# Altium schematic sheet Sheet1.SchDoc
size OrCAD B; SheetNumber: 1; SheetTotal: 1
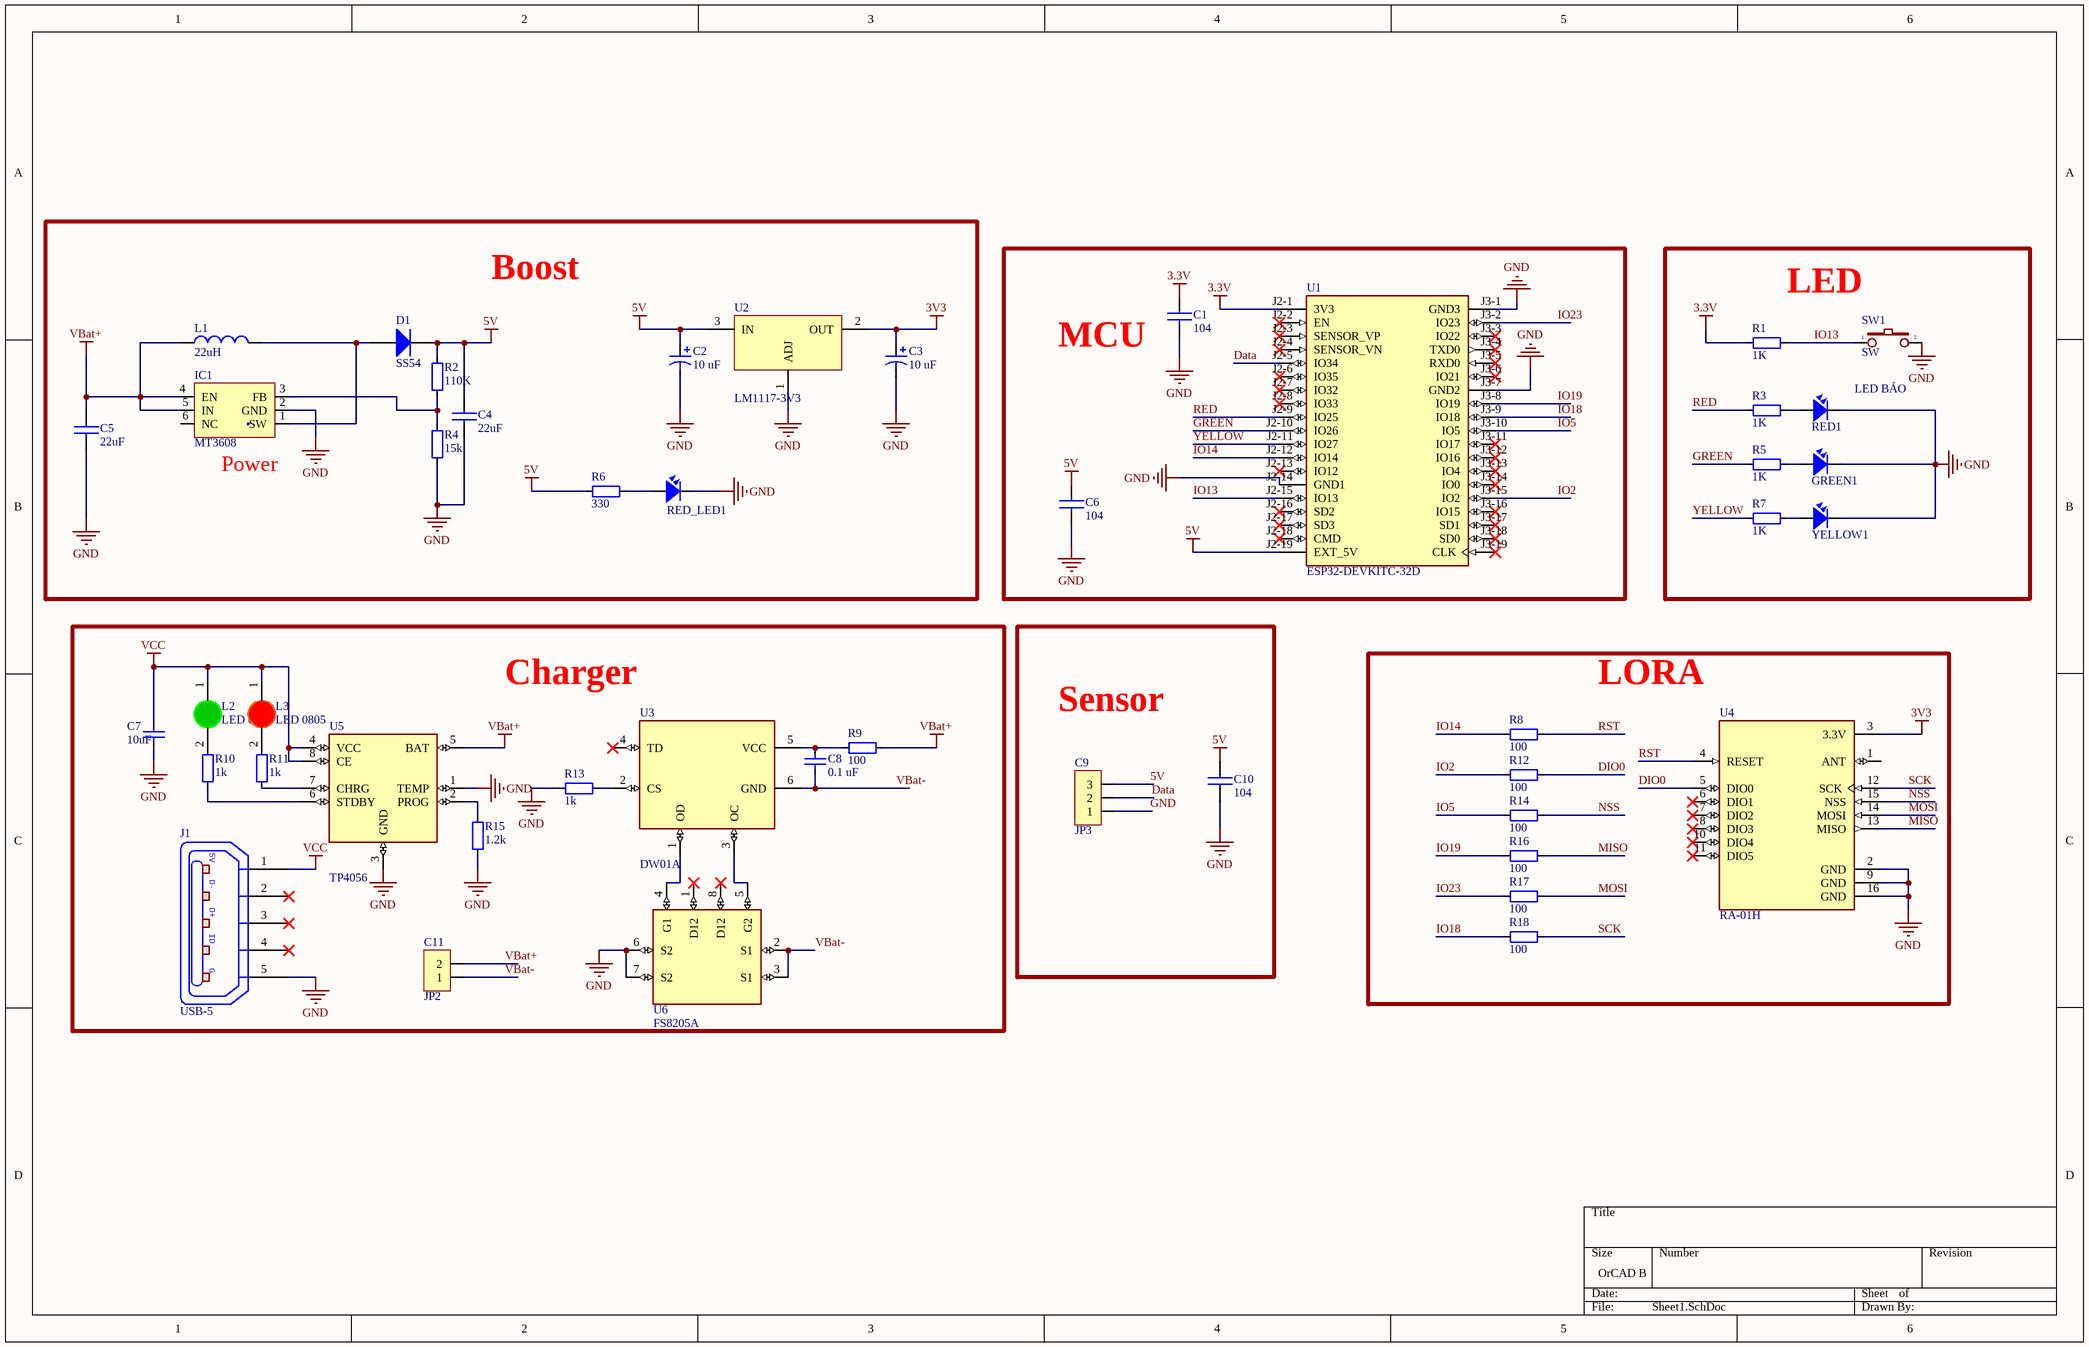
[diagram p0: Sheet1.SchDoc]

## Parts
C1  104  [CAP0603]
C2  10 uF  [C3MM]
C3  10 uF  [C3MM]
C4  22uF  [CAP0603]
C5  22uF  [CAP0603]
C6  104  [CAP0603]
C7  10uF  [CAP_0805]
C8  0.1 uF  [CAP_0805]
C9  JP3  [JP3-C1T]
C10  104  [CAP0603]
C11  JP2  [JP2-C1T]
D1  SS54  [DIODE/POW/1A]
GREEN1  LED  [LED-3MM-GREEN]  (value not drawn)
IC1  MT3608  [TSOP 2]
J1  USB-5  [USB-M1]
L1  22uH  [IND_400_500_212x114_SMD]
L2  LED 0805  [LED-0805-Green]
L3  LED 0805  [LED-0805-Red]
R1  1K  [RES-SMD-0805]
R2  110K  [RES-SMD-0805]
R3  1K  [RES-SMD-0805]
R4  15k  [RES-SMD-0805]
R5  1K  [RES-SMD-0805]
R6  330  [RES-SMD-0805]
R7  1K  [RES-SMD-0805]
R8  100  [RES-SMD-0805]
R9  100  [RES-SMD-0805]
R10  1k  [RES-SMD-0805]
R11  1k  [RES-SMD-0805]
R12  100  [RES-SMD-0805]
R13  1k  [RES-SMD-0805]
R14  100  [RES-SMD-0805]
R15  1.2k  [RES-SMD-0805]
R16  100  [RES-SMD-0805]
R17  100  [RES-SMD-0805]
R18  100  [RES-SMD-0805]
RED1  LED  [LED-3MM-RED]  (value not drawn)
RED_LED1  LED  [LED-3MM-RED]  (value not drawn)
SW1  SW  [SW1-SMD]
U1  ESP32-DEVKITC-32D  [MODULE_ESP32-DEVKITC-32D]
U2  LM1117-3V3  [LM1117-SOP]
U3  DW01A  [SOT23-6]
U4  RA-01H  [XCVR_RA-01H]
U5  TP4056  [TP4056]
U6  FS8205A  [FS8205A]
YELLOW1  LED  [LED-3MM-YELLOW]  (value not drawn)

## Blocks framed on the sheet
Boost: C2-C5 D1 IC1 L1 R2 R4 R6 RED_LED1 U2
MCU: C1 C6 U1
LED: GREEN1 R1 R3 R5 R7 RED1 SW1 YELLOW1
Charger: C7 C8 C11 J1 L2 L3 R9-R11 R13 R15 U3 U5 U6
Sensor: C9 C10
LORA: R8 R12 R14 R16-R18 U4

## Nets
3.3V: C1.1 R1.1 U1.J2-1(3V3)
3V3: C3.1 U2.2(OUT) U4.3(3.3V)
5V: C2.1 C4.1 C6.1 C9.3 C10.1 D1.2(K) R2.2 R6.1 U1.J2-19(EXT_5V) U2.3(IN)
GND: C1.2 C2.2 C3.2 C4.2 C5.2 C6.2 C7.1 C9.1 C10.2 GREEN1.2 IC1.2(GND) J1.5(P5) R4.1 R13.1 R15.1 RED1.2 RED_LED1.2 SW1.2 U1.J2-14(GND1) U1.J3-1(GND3) U1.J3-7(GND2) U2.1(ADJ) U4.2(GND) U4.9(GND) U4.16(GND) U5.1(TEMP) U5.3(GND) U6.6(S2) U6.7(S2) YELLOW1.2
VBat+: C5.1 C11.2 IC1.5(IN) IC1.4(EN) L1.1 R9.2 U5.5(BAT)
VCC: C7.2 J1.1(P1) L2.1(A) L3.1(A) U5.4(VCC) U5.8(CE)
Data: C9.2 U1.J2-5(IO34)
DIO0: R12.2 U4.5(DIO0)
GREEN: R5.1 U1.J2-10(IO26)
IO2: R12.1 U1.J3-15(IO2)
IO5: R14.1 U1.J3-10(IO5)
IO13: R1.2 SW1.1 U1.J2-15(IO13)
IO14: R8.1 U1.J2-12(IO14)
IO18: R18.1 U1.J3-9(IO18)
IO19: R16.1 U1.J3-8(IO19)
IO23: R17.1 U1.J3-2(IO23)
MISO: R16.2 U4.13(MISO)
MOSI: R17.2 U4.14(MOSI)
NSS: R14.2 U4.15(NSS)
RED: R3.1 U1.J2-9(IO25)
RST: R8.2 U4.4(RESET)
SCK: R18.2 U4.12(SCK)
VBat-: C8.1 C11.1 U3.6(GND) U6.2(S1) U6.3(S1)
YELLOW: R7.1 U1.J2-11(IO27)
NetC8_2: C8.2 R9.1 U3.5(VCC)
NetD1_1: D1.1(A) IC1.1(SW) L1.2
NetGREEN1_1: GREEN1.1 R5.2
NetIC1_3: IC1.3(FB) R2.1 R4.2
NetL2_2: L2.2(K) R10.2
NetL3_2: L3.2(K) R11.2
NetR3_2: R3.2 RED1.1
NetR6_2: R6.2 RED_LED1.1
NetR7_2: R7.2 YELLOW1.1
NetR10_1: R10.1 U5.6(STDBY)
NetR11_1: R11.1 U5.7(CHRG)
NetR13_2: R13.2 U3.2(CS)
NetR15_2: R15.2 U5.2(PROG)
NetU3_1: U3.1(OD) U6.4(G1)
NetU3_3: U3.3(OC) U6.5(G2)

Not connected (* = marked no-connect by the designer): IC1 6(NC); J1 2(P2)* 3(P3)* 4(P4)*; U1 J2-2(EN)* J2-3(SENSOR_VP)* J2-4(SENSOR_VN)* J2-6(IO35)* J2-7(IO32)* J2-8(IO33)* J2-13(IO12)* J2-16(SD2)* J2-17(SD3)* J2-18(CMD)* J3-3(IO22)* J3-4(TXD0)* J3-5(RXD0)* J3-6(IO21)* J3-11(IO17)* J3-12(IO16)* J3-13(IO4)* J3-14(IO0)* J3-16(IO15)* J3-17(SD1)* J3-18(SD0)* J3-19(CLK)*; U3 4(TD)*; U4 1(ANT) 6(DIO1)* 7(DIO2)* 8(DIO3)* 10(DIO4)* 11(DIO5)*; U6 1(D12)* 8(D12)*

## Notes on the sheet
- LED BÁO
- (near IC1) Power
- (in symbol USB-5) 5V; D-; D+; ID; G

## Library data of the parts
C1 C4-C6 C10 = CC0603JRNPO9BN300: CAP CER 30PF 50V NPO 0603; Manufacturer: Yageo; Tolerance: ±5%; Temperature Coefficient: C0G, NP0; Notification: Current market demand for these product types have resulted in fluctuating and extending lead times. Lead times may differ.; Supplier 1: Digi-Key; Manufacturer Part Number: CC0603JRNPO9BN300; RoHS: RoHS Compliant; Category: Capacitors; Stock 1: 0; Pricing 1: 1=0.1, 10=0.041, 100=0.0182, 500=0.01302, 1000=0.01022 (USD); Packaging: Cut Tape (CT); Part Status: Active; Voltage - Rated: 50V; Operating Temperature: -55°C ~ 125°C; Features: -; Ratings: -; Applications: General Purpose; Failure Rate: -; Mounting Type: Surface Mount, MLCC; Package / Case: 0603 (1608 Metric); Size / Dimension: 0.063" L x 0.032" W (1.60mm x 0.80mm); Height - Seated (Max): -; Thickness (Max): 0.035" (0.90mm); Lead Spacing: -; Lead Style: -; ComponentLink1URL: http://www.yageo.com/documents/recent/UPY-GP_NP0_16V-to-50V_16.pdf; ComponentLink1Description: http://www.yageo.com/documents/recent/UPY-GP_NP0_16V-to-50V_16.pdf; Supplier Part Number 1: 311-3357-1-ND
C2 C3 = Cap Pol: Polarized Capacitor (Axial); Published: 8-Jun-2000; LatestRevisionDate: 17-Jul-2002; LatestRevisionNote: Re-released for DXP Platform.; PackageReference: POLAR0.8; Publisher: Altium Limited
C7 C8 = CapSMD: Capacitor; Value: 33p; Published: 8-Jun-2000; LatestRevisionDate: 17-Jul-2002; LatestRevisionNote: Re-released for DXP Platform.; PackageReference: RAD-0.3; Publisher: Altium Limited
C9 = JP3: WR-PHD 2.54 mm Angled Socket Header; Manufacturer: W¨¹rth Elektronik eiSos GmbH; partNo: 613003143121; ComponentLink1 Description: Manufacturer; ComponentLink2 Description: Datasheet; NoPins: 03; Created Date: 29 March 2013; ComponentLink1URL: http://www.we-online.com; ComponentLink2URL: http://katalog.we-online.de/em/datasheet/6130xx143121.pdf; Created by: Karrer Zheng
C11 = JP2: WR-PHD 2.54 mm Angled Socket Header; Manufacturer: W¨¹rth Elektronik eiSos GmbH; partNo: 613002143121; ComponentLink1 Description: Manufacturer; ComponentLink2 Description: Datasheet; NoPins: 02; Created Date: 29 March 2013; ComponentLink1URL: http://www.we-online.com; ComponentLink2URL: http://katalog.we-online.de/em/datasheet/6130xx143121.pdf; Created by: Karrer Zheng
D1 = Diode Power: Published: 8-Jun-2000; LatestRevisionDate: 17-Jul-2002; LatestRevisionNote: Re-released for DXP Platform.; DatasheetDocument: 1998; PackageDocument: Aug-1999; PackageReference: DO-201AD; Publisher: Altium Limited; ComponentLink1Description: Manufacturer Link; ComponentLink1URL: http://www.fairchildsemi.com/; ComponentLink2Description: Datasheet; ComponentLink2URL: http://www.fairchildsemi.com/ds/1N%2F1N5400.pdf
GREEN1 RED1 RED_LED1 YELLOW1 = LED: LED Single colour Green and Red; Value: LED 3 ly Single Colour
J1 = USB-5: Manufacturer: FCI; Manufacturer Part Number: 10118193-0001LF; Connector Type: USB - micro B; Number of Contacts: 5; Gender: Receptacle; Specifications: USB 2.0; .Creator: MM; .Checked PCB: RF; Supplier 1: Digi-Key; RoHS: RoHS Compliant; Category: Connectors, Interconnects; Stock 1: 28642; Pricing 1: 1=0.46, 10=0.433, 25=0.3712, 50=0.3156, 100=0.3032, 250=0.27224, 500=0.25988 (USD); Packaging: Cut Tape (CT); Mounting Type: Surface Mount, Right Angle, Horizontal; Features: Shielded, Solder Retention; Ingress Protection: -; ComponentLink1URL: http://portal.fciconnect.com/Comergent//fci/drawing/10118193.pdf; ComponentLink1Description: http://portal.fciconnect.com/Comergent//fci/drawing/10118193.pdf; Supplier Part Number 1: 609-4616-1-ND; .Checked SCH: MM
L1 = IND_1mH-0.6A-20%-SMD: 1mH Shielded Wirewound Inductor 600mA 1.82Ohm Max Nonstandard; Manufacturer: Coilcraft; Manufacturer Part Number: 74477030; Alternate Part Number-1: NA; Case/Package: SMD; Supplier-1: WURTH; Supplier Part Number-1: 74477030
L2 = LED 0805 Xanh La: Dán; Don_Vi: Con; Ma_Hang: MH002326; Ten_Linh_Kien: LED 0805 Màu Xanh Lá (Green); Ghi_Chu: *; Kieu_Chan: *; Chung_Loai: Dán
L3 = LED 0805 Do: Dán; Don_Vi: Con; Ma_Hang: MH000897; Ten_Linh_Kien: LED 0805 Màu Đỏ (Red); Ghi_Chu: *; Kieu_Chan: *; Chung_Loai: Dán
R1-R18 = Resistor - SMD: Resistor; Manufacturer: Generic Components; Class: Passive; Published: 08/06/2000; Publisher: Altium Hobart Technology Centre
SW1 = SW2: Switch button 2 pin; Value: SW chip 2 pin
U1 = ESP32-DEVKITC-32D: WiFi Development Tools (802.11) ESP32 General Development Kit, ESP32-WROOM-32D on the board; MF: Espressif Systems; SnapEDA_Link: https://www.snapeda.com/parts/ESP32-DEVKITC-32D/Espressif+Systems/view-part/?ref=snap; Package: None; Value: *; MP: ESP32-DEVKITC-32D; Check_prices: https://www.snapeda.com/parts/ESP32-DEVKITC-32D/Espressif+Systems/view-part/?ref=eda
U2 = LM1117-ADJ: 800mA Low-Dropout Linear Regulator; Creator: Nguyen Ba Bien; Website: http://group3i.net
U3 = DW01A: One Cell Lithium-ion/Polymer Battery Protection IC
U4 = RA-01H: MÃ´-Ä‘un thu phÃ¡t LoRaâ„¢ ISM < 1GHz chung KhÃ´ng bao gá»“m Äƒng-ten 803 MHz ~ 930 MHz GiÃ¡ treo bá» máº·t; MF: AI-Thinker; SnapEDA_Link: https://www.snapeda.com/parts/RA-01H/AI-Thinker/view-part/?ref=snap; Package: Package; Value: *; MP: RA-01H; Check_prices: https://www.snapeda.com/parts/RA-01H/AI-Thinker/view-part/?ref=eda
U5 = TP4056: Complete single cell Li-Ion battery with a constant current / constant voltage linear charger